# Altium schematic sheet Docking Station.SchDoc
size A4
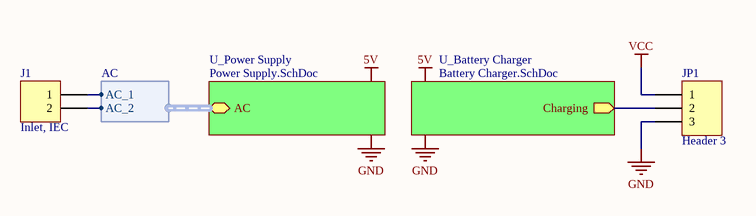
[diagram p0: Docking Station.SchDoc]

## Parts
J1  Inlet, IEC  [Inlet, IEC - Plug]
JP1  Header 3  [HDR1X3]

## Sub-sheets
U_Battery Charger = Battery Charger.SchDoc: Charging (out)
U_Power Supply = Power Supply.SchDoc: AC (harness AC)

## Harnesses
AC: AC_1, AC_2

## Nets
GND: JP1.3
VCC: JP1.1
NetJ1_1: J1.1 ; sheet U_Power Supply/AC.AC_1
NetJ1_2: J1.2 ; sheet U_Power Supply/AC.AC_2
NetJP1_2: JP1.2 ; sheet U_Battery Charger/Charging

## Notes on the sheet
- Labels drawn without touching a wire or pin: 5V, GND

## Library data of the parts
J1 = Inlet, IEC - Plug
JP1 = Header 3: Header, 3-Pin